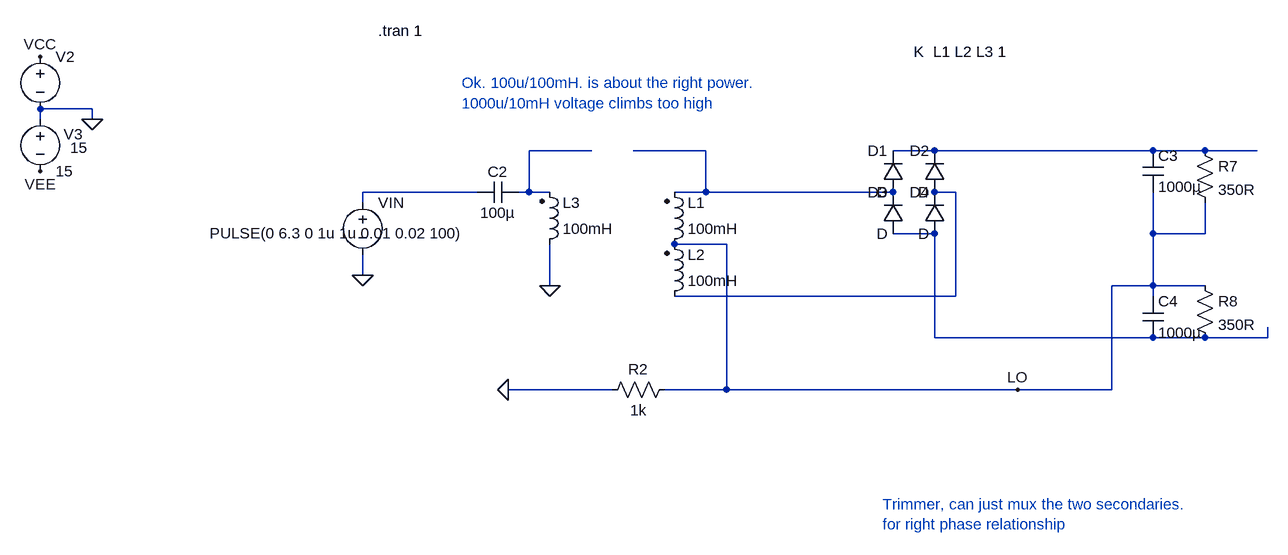
[diagram p0: schematic Draft04.asc]
Draft04.asc, the LTspice schematic file:
Version 4
SHEET 1 2356 712
WIRE -464 -16 -544 -16
WIRE -544 0 -544 -16
WIRE -464 0 -464 -16
WIRE 304 48 208 48
WIRE 480 48 368 48
WIRE 832 48 768 48
WIRE 1168 48 832 48
WIRE 1248 48 1168 48
WIRE 1328 48 1248 48
WIRE 128 112 -48 112
WIRE 208 112 208 48
WIRE 208 112 192 112
WIRE 240 112 208 112
WIRE 480 112 480 48
WIRE 480 112 432 112
WIRE 768 112 480 112
WIRE 864 112 832 112
WIRE -48 128 -48 112
WIRE 832 176 768 176
WIRE 1168 176 1168 112
WIRE 1248 176 1248 128
WIRE 1248 176 1168 176
WIRE 512 192 432 192
WIRE -48 240 -48 208
WIRE 240 256 240 192
WIRE 1168 256 1168 176
WIRE 1168 256 1104 256
WIRE 1248 256 1168 256
WIRE 864 272 864 112
WIRE 864 272 432 272
WIRE 1168 272 1168 256
WIRE 832 336 832 176
WIRE 1168 336 832 336
WIRE 1248 336 1168 336
WIRE 1344 336 1344 320
WIRE 1344 336 1248 336
WIRE 336 416 176 416
WIRE 512 416 512 192
WIRE 512 416 416 416
WIRE 960 416 512 416
WIRE 1104 416 1104 256
WIRE 1104 416 960 416
FLAG -464 0 0
FLAG -48 240 0
FLAG -544 -96 VCC
FLAG -544 80 VEE
FLAG 240 256 0
FLAG 960 416 LO
FLAG 176 416 0
SYMBOL voltage -48 112 R0
WINDOW 123 0 0 Left 0
WINDOW 39 0 0 Left 0
WINDOW 3 -235 63 Left 2
SYMATTR Value PULSE(0 6.3 0 1u 1u 0.01 0.02 100)
SYMATTR InstName VIN
SYMBOL voltage -544 -112 R0
WINDOW 123 0 0 Left 0
WINDOW 39 0 0 Left 0
WINDOW 3 46 156 Left 2
SYMATTR Value 15
SYMATTR InstName V2
SYMBOL voltage -544 -16 R0
WINDOW 123 0 0 Left 0
WINDOW 39 0 0 Left 0
WINDOW 0 36 39 Left 2
SYMATTR InstName V3
SYMATTR Value 15
SYMBOL ind2 416 208 M180
WINDOW 0 36 80 Left 2
WINDOW 3 36 40 Left 2
SYMATTR InstName L1
SYMATTR Value 100mH
SYMATTR Type ind
SYMBOL diode 784 112 R180
WINDOW 0 24 64 Left 2
WINDOW 3 24 0 Left 2
SYMATTR InstName D1
SYMBOL diode 848 112 R180
WINDOW 0 24 64 Left 2
WINDOW 3 24 0 Left 2
SYMATTR InstName D2
SYMBOL diode 784 176 R180
WINDOW 0 24 64 Left 2
WINDOW 3 24 0 Left 2
SYMATTR InstName D3
SYMBOL diode 848 176 R180
WINDOW 0 24 64 Left 2
WINDOW 3 24 0 Left 2
SYMATTR InstName D4
SYMBOL cap 1152 48 R0
SYMATTR InstName C3
SYMATTR Value 1000µ
SYMBOL res 1232 32 R0
SYMATTR InstName R7
SYMATTR Value 350R
SYMBOL ind2 416 288 M180
WINDOW 0 36 80 Left 2
WINDOW 3 36 40 Left 2
SYMATTR InstName L2
SYMATTR Value 100mH
SYMATTR Type ind
SYMBOL cap 1152 272 R0
SYMATTR InstName C4
SYMATTR Value 1000µ
SYMBOL res 1232 240 R0
SYMATTR InstName R8
SYMATTR Value 350R
SYMBOL ind2 224 208 M180
WINDOW 0 36 80 Left 2
WINDOW 3 36 40 Left 2
SYMATTR InstName L3
SYMATTR Value 100mH
SYMATTR Type ind
SYMBOL res 432 400 R90
WINDOW 0 0 56 VBottom 2
WINDOW 3 32 56 VTop 2
SYMATTR InstName R2
SYMATTR Value 1k
SYMBOL cap 192 96 R90
WINDOW 0 0 32 VBottom 2
WINDOW 3 32 32 VTop 2
SYMATTR InstName C2
SYMATTR Value 100µ
TEXT -24 -136 Left 2 !.tran 1
TEXT 800 -104 Left 2 !K  L1 L2 L3 1
TEXT 752 592 Left 2 ;Trimmer, can just mux the two secondaries.\nfor right phase relationship
TEXT 104 -56 Left 2 ;Ok. 100u/100mH. is about the right power.\n1000u/10mH voltage climbs too high

The netlist it stands for:
* Draft04.asc
VIN N004 0 PULSE(0 6.3 0 1u 1u 0.01 0.02 100)
V2 VCC 0 15
V3 0 VEE 15
L1 LO N002 100mH
D1 N002 N003 D
D2 N005 N003 D
D3 N006 N002 D
D4 N006 N005 D
C3 N003 LO 1000µ
R7 N003 LO 350R
L2 N005 LO 100mH
C4 LO N006 1000µ
R8 LO N006 350R
L3 0 N001 100mH
R2 LO 0 1k
C2 N001 N004 100µ
.model D D
.lib standard.dio
.tran 1
K  L1 L2 L3 1
* Trimmer, can just mux the two secondaries.
* for right phase relationship
* Ok. 100u/100mH. is about the right power.
* 1000u/10mH voltage climbs too high
.backanno
.end